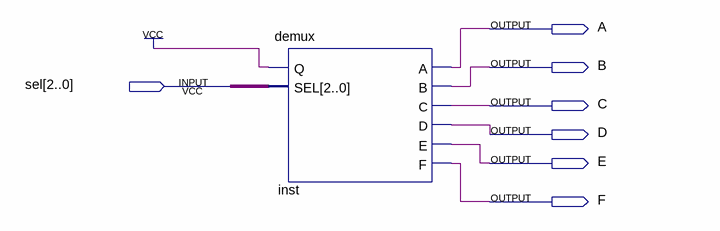
[diagram p0: schematic sheet]
// Quartus schematic test_demux.bdf as structural Verilog: 1 symbols, 7 pins
module test_demux (
  input  [2:0] sel,
  output A,
  output B,
  output C,
  output D,
  output E,
  output F
);

  demux inst (.Q(1'b1), .SEL(sel), .A(A), .B(B), .C(C), .D(D), .E(E), .F(F));
endmodule
